# Altium schematic sheet LAN9252-2.SchDoc
size B
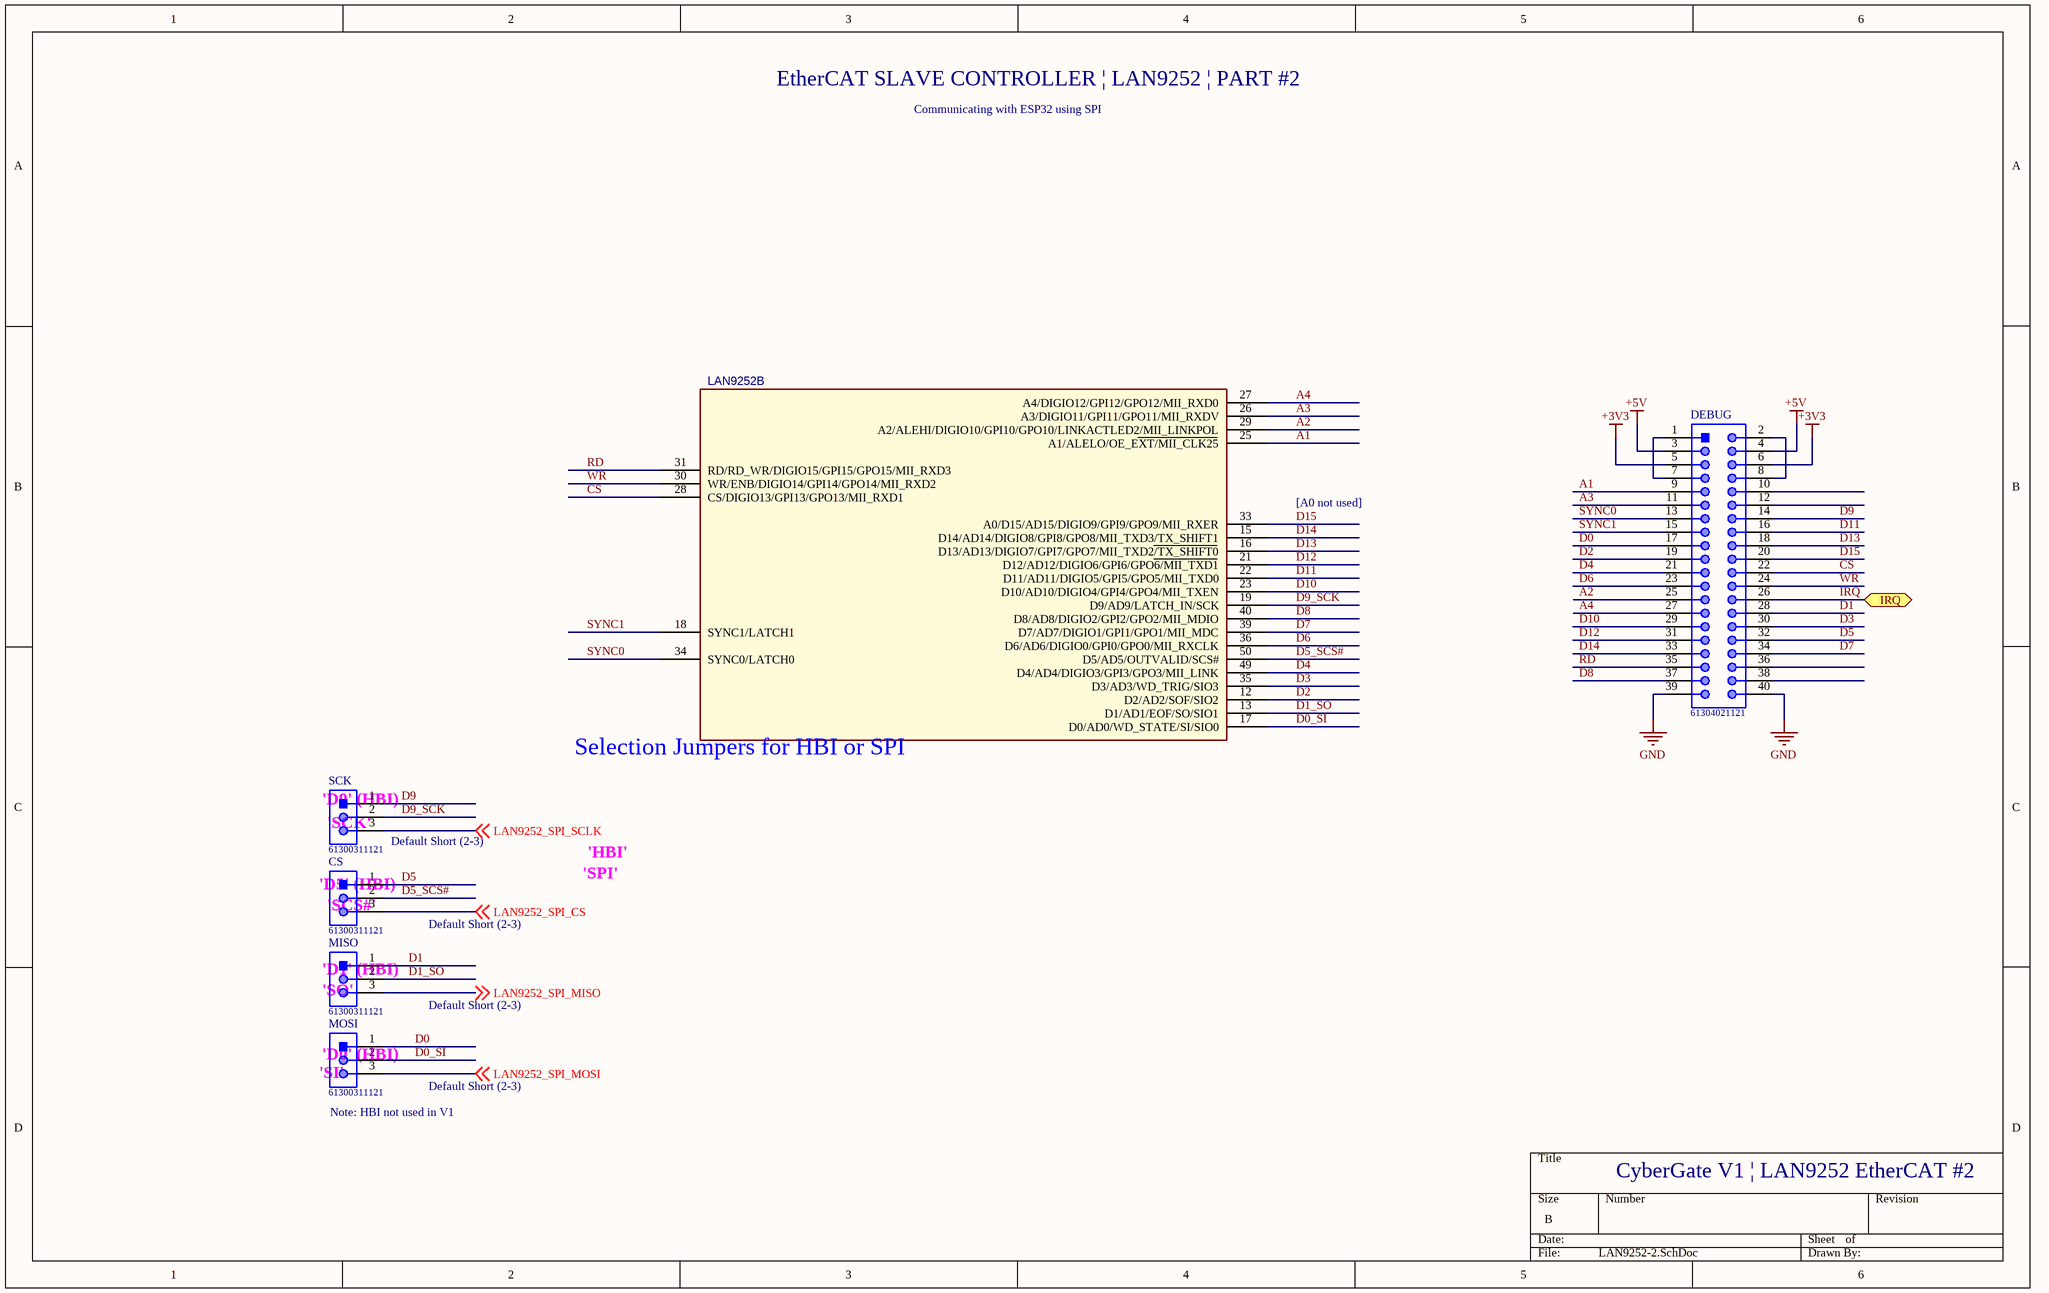
[diagram p0: LAN9252-2.SchDoc]

## Parts
CS  61300311121  [61300311121]
DEBUG  61304021121  [61304021121]
LAN9252  (no value)  [LAN9252_QFN]  (part B of 2)
MISO  61300311121  [61300311121]
MOSI  61300311121  [61300311121]
SCK  61300311121  [61300311121]

## Ports
IRQ (bidir)

## Nets
+3V3: DEBUG.5 DEBUG.6
+5V: DEBUG.3 DEBUG.4
GND: DEBUG.39 DEBUG.40
A1: DEBUG.9 LAN9252.25(A1/ALELO/OE_EXT/MII_CLK25)
A2: DEBUG.25 LAN9252.29(A2/ALEHI/DIGIO10/GPI10/GPO10/LINKACTLED2/MII_LINKPOL)
A3: DEBUG.11 LAN9252.26(A3/DIGIO11/GPI11/GPO11/MII_RXDV)
A4: DEBUG.27 LAN9252.27(A4/DIGIO12/GPI12/GPO12/MII_RXD0)
CS: DEBUG.22 LAN9252.28(CS/DIGIO13/GPI13/GPO13/MII_RXD1)
D0: DEBUG.17 MOSI.1
D0_SI: LAN9252.17(D0/AD0/WD_STATE/SI/SIO0) MOSI.2
D1: DEBUG.28 MISO.1
D1_SO: LAN9252.13(D1/AD1/EOF/SO/SIO1) MISO.2
D2: DEBUG.19 LAN9252.12(D2/AD2/SOF/SIO2)
D3: DEBUG.30 LAN9252.35(D3/AD3/WD_TRIG/SIO3)
D4: DEBUG.21 LAN9252.49(D4/AD4/DIGIO3/GPI3/GPO3/MII_LINK)
D5: CS.1 DEBUG.32
D5_SCS#: CS.2 LAN9252.50(D5/AD5/OUTVALID/SCS#)
D6: DEBUG.23 LAN9252.36(D6/AD6/DIGIO0/GPI0/GPO0/MII_RXCLK)
D7: DEBUG.34 LAN9252.39(D7/AD7/DIGIO1/GPI1/GPO1/MII_MDC)
D8: DEBUG.37 LAN9252.40(D8/AD8/DIGIO2/GPI2/GPO2/MII_MDIO)
D9: DEBUG.14 SCK.1
D9_SCK: LAN9252.19(D9/AD9/LATCH_IN/SCK) SCK.2
D10: DEBUG.29 LAN9252.23(D10/AD10/DIGIO4/GPI4/GPO4/MII_TXEN)
D11: DEBUG.16 LAN9252.22(D11/AD11/DIGIO5/GPI5/GPO5/MII_TXD0)
D12: DEBUG.31 LAN9252.21(D12/AD12/DIGIO6/GPI6/GPO6/MII_TXD1)
D13: DEBUG.18 LAN9252.16(D13/AD13/DIGIO7/GPI7/GPO7/MII_TXD2/TX_SHIFT0)
D14: DEBUG.33 LAN9252.15(D14/AD14/DIGIO8/GPI8/GPO8/MII_TXD3/TX_SHIFT1)
D15: DEBUG.20 LAN9252.33(A0/D15/AD15/DIGIO9/GPI9/GPO9/MII_RXER)
IRQ: DEBUG.26 ; port IRQ
LAN9252_SPI_CS: CS.3 ; off-sheet LAN9252_SPI_CS
LAN9252_SPI_MISO: MISO.3 ; off-sheet LAN9252_SPI_MISO
LAN9252_SPI_MOSI: MOSI.3 ; off-sheet LAN9252_SPI_MOSI
LAN9252_SPI_SCLK: SCK.3 ; off-sheet LAN9252_SPI_SCLK
RD: DEBUG.35 LAN9252.31(RD/RD_WR/DIGIO15/GPI15/GPO15/MII_RXD3)
SYNC0: DEBUG.13 LAN9252.34(SYNC0/LATCH0)
SYNC1: DEBUG.15 LAN9252.18(SYNC1/LATCH1)
WR: DEBUG.24 LAN9252.30(WR/ENB/DIGIO14/GPI14/GPO14/MII_RXD2)
NetDEBUG_1: DEBUG.1 DEBUG.7
NetDEBUG_2: DEBUG.2 DEBUG.8

Not connected (* = marked no-connect by the designer): DEBUG 10 12 36 38

## Notes on the sheet
- EtherCAT SLAVE CONTROLLER | LAN9252 | PART #2
- Communicating with ESP32 using SPI
- [A0 not used]
- (near SCK) Selection Jumpers for HBI or SPI
- (near SCK) 'D9' (HBI)
- (near SCK) 'SCK'
- 'D5' (HBI)
- (near CS) 'SCS#'
- Default Short (2-3)
- 'SPI'
- 'HBI'
- (near MISO) 'D1' (HBI)
- (near MISO) 'SO'
- (near MOSI) 'SI'
- (near MOSI) 'D0' (HBI)
- (near MOSI) Note: HBI not used in V1
- CyberGate V1 | LAN9252 EtherCAT #2

## Library data of the parts
CS MISO MOSI SCK = CMP-1502-01062-1: THT Vertical Pin Header WR-PHD, Pitch 2.54 mm, Single Row, 3 pins; Manufacturer: Wurth Elektronik; Withstanding Voltage: 500VAC; Working Voltage: 250VAC; Rated Current: 3A; Pitch: 2.54mm; Pin Number: 3; Gender: Male; Contact Resistance: 20mOhm; Package Reference: 61300311121; Manufacturer URL: http://www.we-online.de; Datasheet URL: https://katalog.we-online.de/em/datasheet/6130xx11121.pdf; Operating Temperature: -40to105degC; Part Number: 61300311121; Orientation: Vertical; Packaging: Bag; Row Number: Single; Mounting Technology: THT; Publisher: WurthElektronik
DEBUG = CMP-1502-01135-1: THT Vertical Pin Header WR-PHD, Pitch 2.54 mm, Dual Row, 40 pins; Manufacturer: Wurth Elektronik; Contact Resistance: 20mOhm; Pitch: 2.54mm; Pin Number: 40; Withstanding Voltage: 500VAC; Gender: Male; Rated Current: 3A; Working Voltage: 250VAC; Operating Temperature: -40to105degC; Manufacturer URL: http://www.we-online.de; Orientation: Vertical; Datasheet URL: https://katalog.we-online.de/em/datasheet/6130xx21121.pdf; Package Reference: 61304021121; Row Number: Dual; Part Number: 61304021121; Packaging: Bag; Mounting Technology: THT; Publisher: WurthElektronik
LAN9252 = LAN9252_QFN64: IC, 2/3-Port EtherCAT® Slave Controller, QFN64; Manufacturer Part Number 1: LAN9252x/ML; Manufacturer 1: Microchip; Populated: Yes; Owner: Manikandan; Supplier Part Number 1: LAN9252I/ML-ND; Supplier 1: Digikey; Description_: IC, 2/3-Port EtherCAT® Slave Controller, QFN64; RoHS: Yes; Package: QFN64-9X9x1; Document Link: http://ww1.microchip.com/downloads/en/DeviceDoc/00001909A.pdf; Status: New